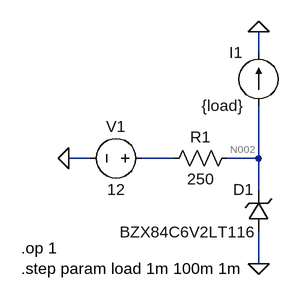
[diagram p0: schematic Zener_current_sweep.asc]
Zener_current_sweep.asc, the LTspice schematic file:
Version 4
SHEET 1 880 680
WIRE 288 -96 288 -128
WIRE 32 64 0 64
WIRE 160 64 112 64
WIRE 288 64 288 -16
WIRE 288 64 240 64
WIRE 288 112 288 64
WIRE 288 224 288 176
FLAG 0 64 0
FLAG 288 224 0
FLAG 288 -128 0
SYMBOL voltage 128 64 R90
WINDOW 0 -32 56 VBottom 2
WINDOW 3 32 56 VTop 2
WINDOW 123 0 0 Left 0
WINDOW 39 0 0 Left 0
SYMATTR InstName V1
SYMATTR Value 12
SYMBOL res 256 48 R90
WINDOW 0 0 56 VBottom 2
WINDOW 3 32 56 VTop 2
SYMATTR InstName R1
SYMATTR Value 250
SYMBOL zener 304 176 R180
WINDOW 0 24 64 Left 2
WINDOW 3 24 0 Left 2
SYMATTR InstName D1
SYMATTR Value BZX84C6V2LT116
SYMBOL current 288 -16 R180
WINDOW 0 24 80 Left 2
WINDOW 3 24 0 Left 2
WINDOW 123 0 0 Left 0
WINDOW 39 24 52 Left 2
SYMATTR InstName I1
SYMATTR Value {load}
TEXT -72 200 Left 2 !.op 1\n.step param load 1m 100m 1m

The netlist it stands for:
* Zener_current_sweep.asc
V1 N001 0 12
R1 N002 N001 250
D1 0 N002 BZX84C6V2LT116
I1 N002 0 {load}
.model D D
.lib standard.dio
.op 1
.step param load 1m 100m 1m
.backanno
.end

* Results of the author's LTspice run, read from the files saved beside the schematic
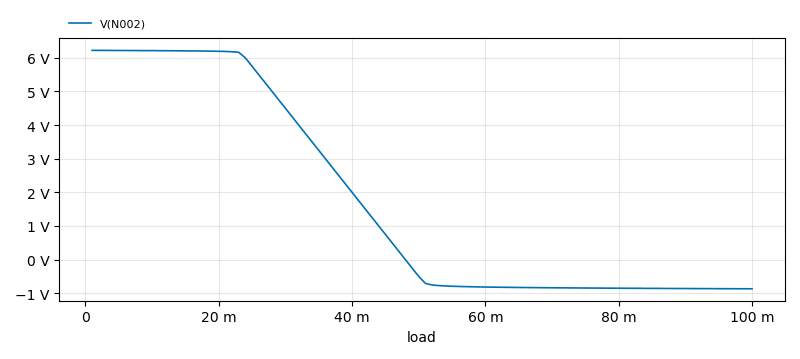
[diagram p1: Operating Point of Zener_current_sweep.asc, plotted from the saved traces]
* Operating Point, 1 run:
*   V(N002): 6.223 V at load=1 m, -868.3 mV at load=100 m, min -868.3 mV, max 6.223 V
* From the log:
*   Semiconductor Device Operating Points:
*                           --- Diodes ---
*   Name:        d1
*   Model: bzx84c6v2lt116
*   Id:      -2.21e-02
*   Vd:      -6.22e+00
*   Req:      5.85e-01
*   CAP:      1.11e-07